# Altium schematic sheet triger.SchDoc
size A4
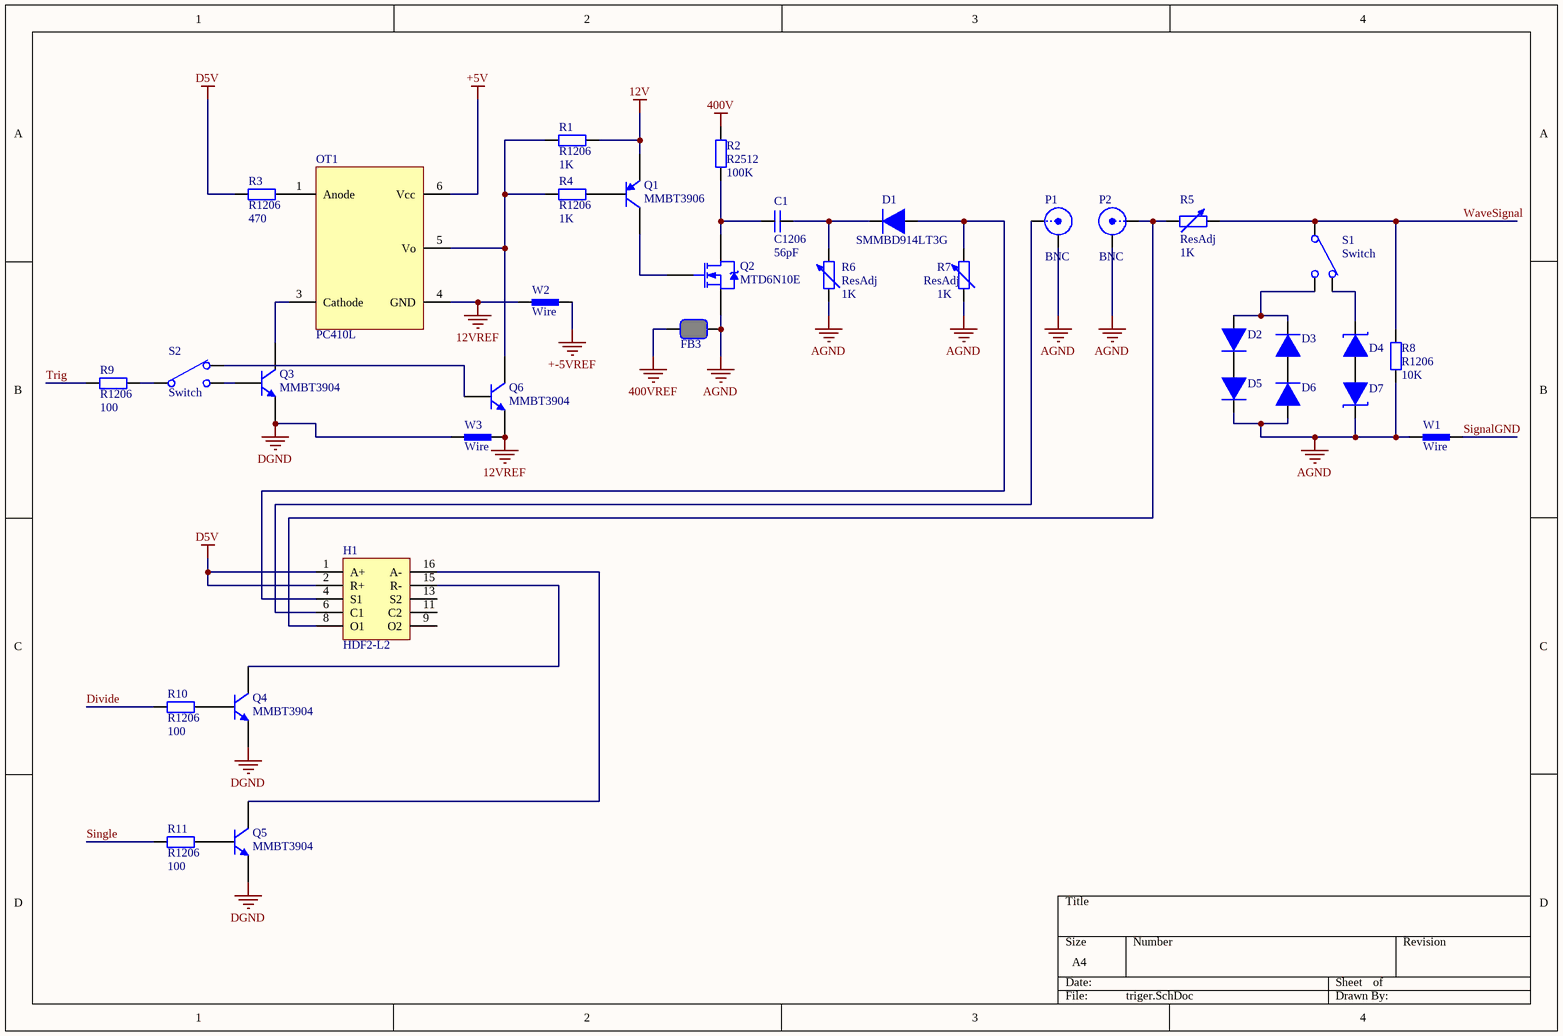
[diagram p0: triger.SchDoc]

## Parts
C1  C1206  value 56pF  [1206]
D1  SMMBD914LT3G  [SMMBD914LT3G]
D2  SMMBD914LT3G  [SMMBD914LT3G]  (value not drawn)
D3  SMMBD914LT3G  [SMMBD914LT3G]  (value not drawn)
D4  ZMM2V4  [DIODE1206]  (value not drawn)
D5  SMMBD914LT3G  [SMMBD914LT3G]  (value not drawn)
D6  SMMBD914LT3G  [SMMBD914LT3G]  (value not drawn)
D7  ZMM2V4  [DIODE1206]  (value not drawn)
FB3  FB0805  [0805]  (value not drawn)
H1  HDF2-L2  [RELAY-HFD2-L2]
OT1  PC410L  [SOP5]
P1  BNC  [BNC_RA CON]
P2  BNC  [BNC_RA CON]
Q1  MMBT3906  [SOT23_M]
Q2  MTD6N10E  [369A-13]
Q3  MMBT3904  [SOT23_M]
Q4  MMBT3904  [SOT23_M]
Q5  MMBT3904  [SOT23_M]
Q6  MMBT3904  [SOT23_M]
R1  R1206  value 1K  [1206]
R2  R2512  value 100K  [2512]
R3  R1206  value 470  [1206]
R4  R1206  value 1K  [1206]
R5  ResAdj  value 1K  [Adjust Resistor]
R6  ResAdj  value 1K  [Adjust Resistor]
R7  ResAdj  value 1K  [Adjust Resistor]
R8  R1206  value 10K  [1206]
R9  R1206  value 100  [1206]
R10  R1206  value 100  [1206]
R11  R1206  value 100  [1206]
S1  Switch  [MSS-22C02]
S2  Switch  [MSS-22C02]
W1  Wire  [WIRE]
W2  Wire  [WIRE]
W3  Wire  [WIRE]

## Nets
12V: Q1.2(E) R1.2(b)
12VREF: OT1.4(GND) Q6.2(E) W2.1(a) W3.2(b)
400V: R2.2(b)
400VREF: FB3.2(b)
+5V: OT1.6(Vcc)
+-5VREF: W2.2(b)
AGND: D5.3(c) D6.1(a) D7.2(b) FB3.1(a) P1.2(Y) P2.2(Y) Q2.3(S) R6.a R7.a R8.1(a) W1.1(a)
D5V: H1.1(A+) H1.2(R+) R3.1(a)
DGND: Q3.2(E) Q4.2(E) Q5.2(E) W3.1(a)
Divide: R10.1(a)
SignalGND: W1.2(b)
Single: R11.1(a)
Trig: R9.1(a)
WaveSignal: R5.b R8.2(b) S1.a
NetC1_1: C1.1(a) Q2.4(D) R2.1(a)
NetC1_2: C1.2(b) D1.3(c) R6.b
NetD1_1: D1.1(a) H1.4(S1) R7.b
NetD2_1: D2.1(a) D3.3(c) S1.c
NetD2_3: D2.3(c) D5.1(a)
NetD3_1: D3.1(a) D6.3(c)
NetD4_1: D4.1(a) D7.1(a)
NetD4_2: D4.2(b) S1.b
NetH1_6: H1.6(C1) P1.1(X)
NetH1_8: H1.8(O1) P2.1(X) R5.a
NetH1_15: H1.15(R-) Q4.3(C)
NetH1_16: H1.16(A-) Q5.3(C)
NetOT1_1: OT1.1(Anode) R3.2(b)
NetOT1_3: OT1.3(Cathode) Q3.3(C)
NetOT1_5: OT1.5(Vo) Q6.3(C) R1.1(a) R4.1(a)
NetQ1_1: Q1.1(B) R4.2(b)
NetQ1_3: Q1.3(C) Q2.1(G)
NetQ3_1: Q3.1(B) S2.c
NetQ4_1: Q4.1(B) R10.2(b)
NetQ5_1: Q5.1(B) R11.2(b)
NetQ6_1: Q6.1(B) S2.b
NetR9_2: R9.2(b) S2.a

Not connected (* = marked no-connect by the designer): H1 9(O2) 11(C2) 13(S2)

## Library data of the parts
C1 = C1206: Capacitor, 1206
D1-D3 D5 D6 = SMMBD914LT3G: Switching Diode
D4 D7 = ZMM2V4: Voltage Stabilizing Diode, 2.4V
FB3 = FB0805: Chip Bead, 0805
H1 = Relay-HDF2-L2: Relay, HDF2-XX-XX-L2-XX
P1 P2 = BNC: BNC Elbow Connector; LatestRevisionDate: 17-Jul-2002; LatestRevisionNote: Re-released for DXP Platform.; Publisher: Altium Limited
Q1 = MMBT3906: PNP Switching Transistor; Published: 17-Sep-2003; LatestRevisionDate: 12-Dec-2006; LatestRevisionNote: IPC-7351 Footprint Added.; DatasheetVersion: 11-Apr-2000; PackageVersion: May-1999; PackageReference: SOT23; Publisher: Altium Limited; PackageDescription: 3-Pin SOT-23 Package 0.95 mm Pitch, 2.3 mm Lead Span; ComponentLink1Description: Manufacturer Link; ComponentLink1URL: http://www.semiconductors.philips.com/; ComponentLink2Description: Datasheet; ComponentLink2URL: http://www.semiconductors.philips.com/acrobat/datasheets/MMBT3906_2.pdf
Q2 = MTD6N10E: TMOS E-FET Power Field Effect Transistor DPAK for Surface Mount; Note: Pin 2 is trimmed and is electrically connected to Pin 4 (Drain); Published: 29-Sep-2000; LatestRevisionDate: 17-Jul-2002; LatestRevisionNote: PCB Footprint, 'SIP-G3/Z11' replaced; Re-released for DXP Platform.; DatasheetVersion: 1995; PackageVersion: 1997; PackageReference: 369A-13; Publisher: Altium Limited; PackageDescription: D-PAK/TO-252-AA; 3 Leads (1 Cropped); Body 10.3 (inc. leads) x 6.7 mm (LxW max); ComponentLink1Description: Manufacturer Link; ComponentLink1URL: http://www.onsemi.com/site/products/landing?taxonomyID=194; ComponentLink2Description: Datasheet; ComponentLink2URL: http://www.onsemi.com/pub/Collateral/MTD6N10E-D.PDF
Q3-Q6 = MMBT3904: NPN Switching Transistor; Published: 17-Sep-2003; LatestRevisionDate: 12-Dec-2006; LatestRevisionNote: IPC-7351 Footprint Added.; DatasheetVersion: 13-May-2002; PackageVersion: May-1999; PackageReference: SOT23; Publisher: Altium Limited; PackageDescription: 3-Pin SOT-23 Package 0.95 mm Pitch, 2.3 mm Lead Span; ComponentLink1Description: Manufacturer Link; ComponentLink1URL: http://www.semiconductors.philips.com/; ComponentLink2Description: Datasheet; ComponentLink2URL: http://www.semiconductors.philips.com/acrobat/datasheets/MMBT3904_4.pdf
R1 R3 R4 R8-R11 = R1206: Resistor, 1206, 1/4W
R2 = R2512: Resistor, 2512, 1W
R5-R7 = ResAdj: Adjustable Resistor
S1 S2 = MSS-22C02: Duble Switch